# Altium project iMX6 Rex Development Baseboard V1I1.PrjPcb (part 2 of 2)
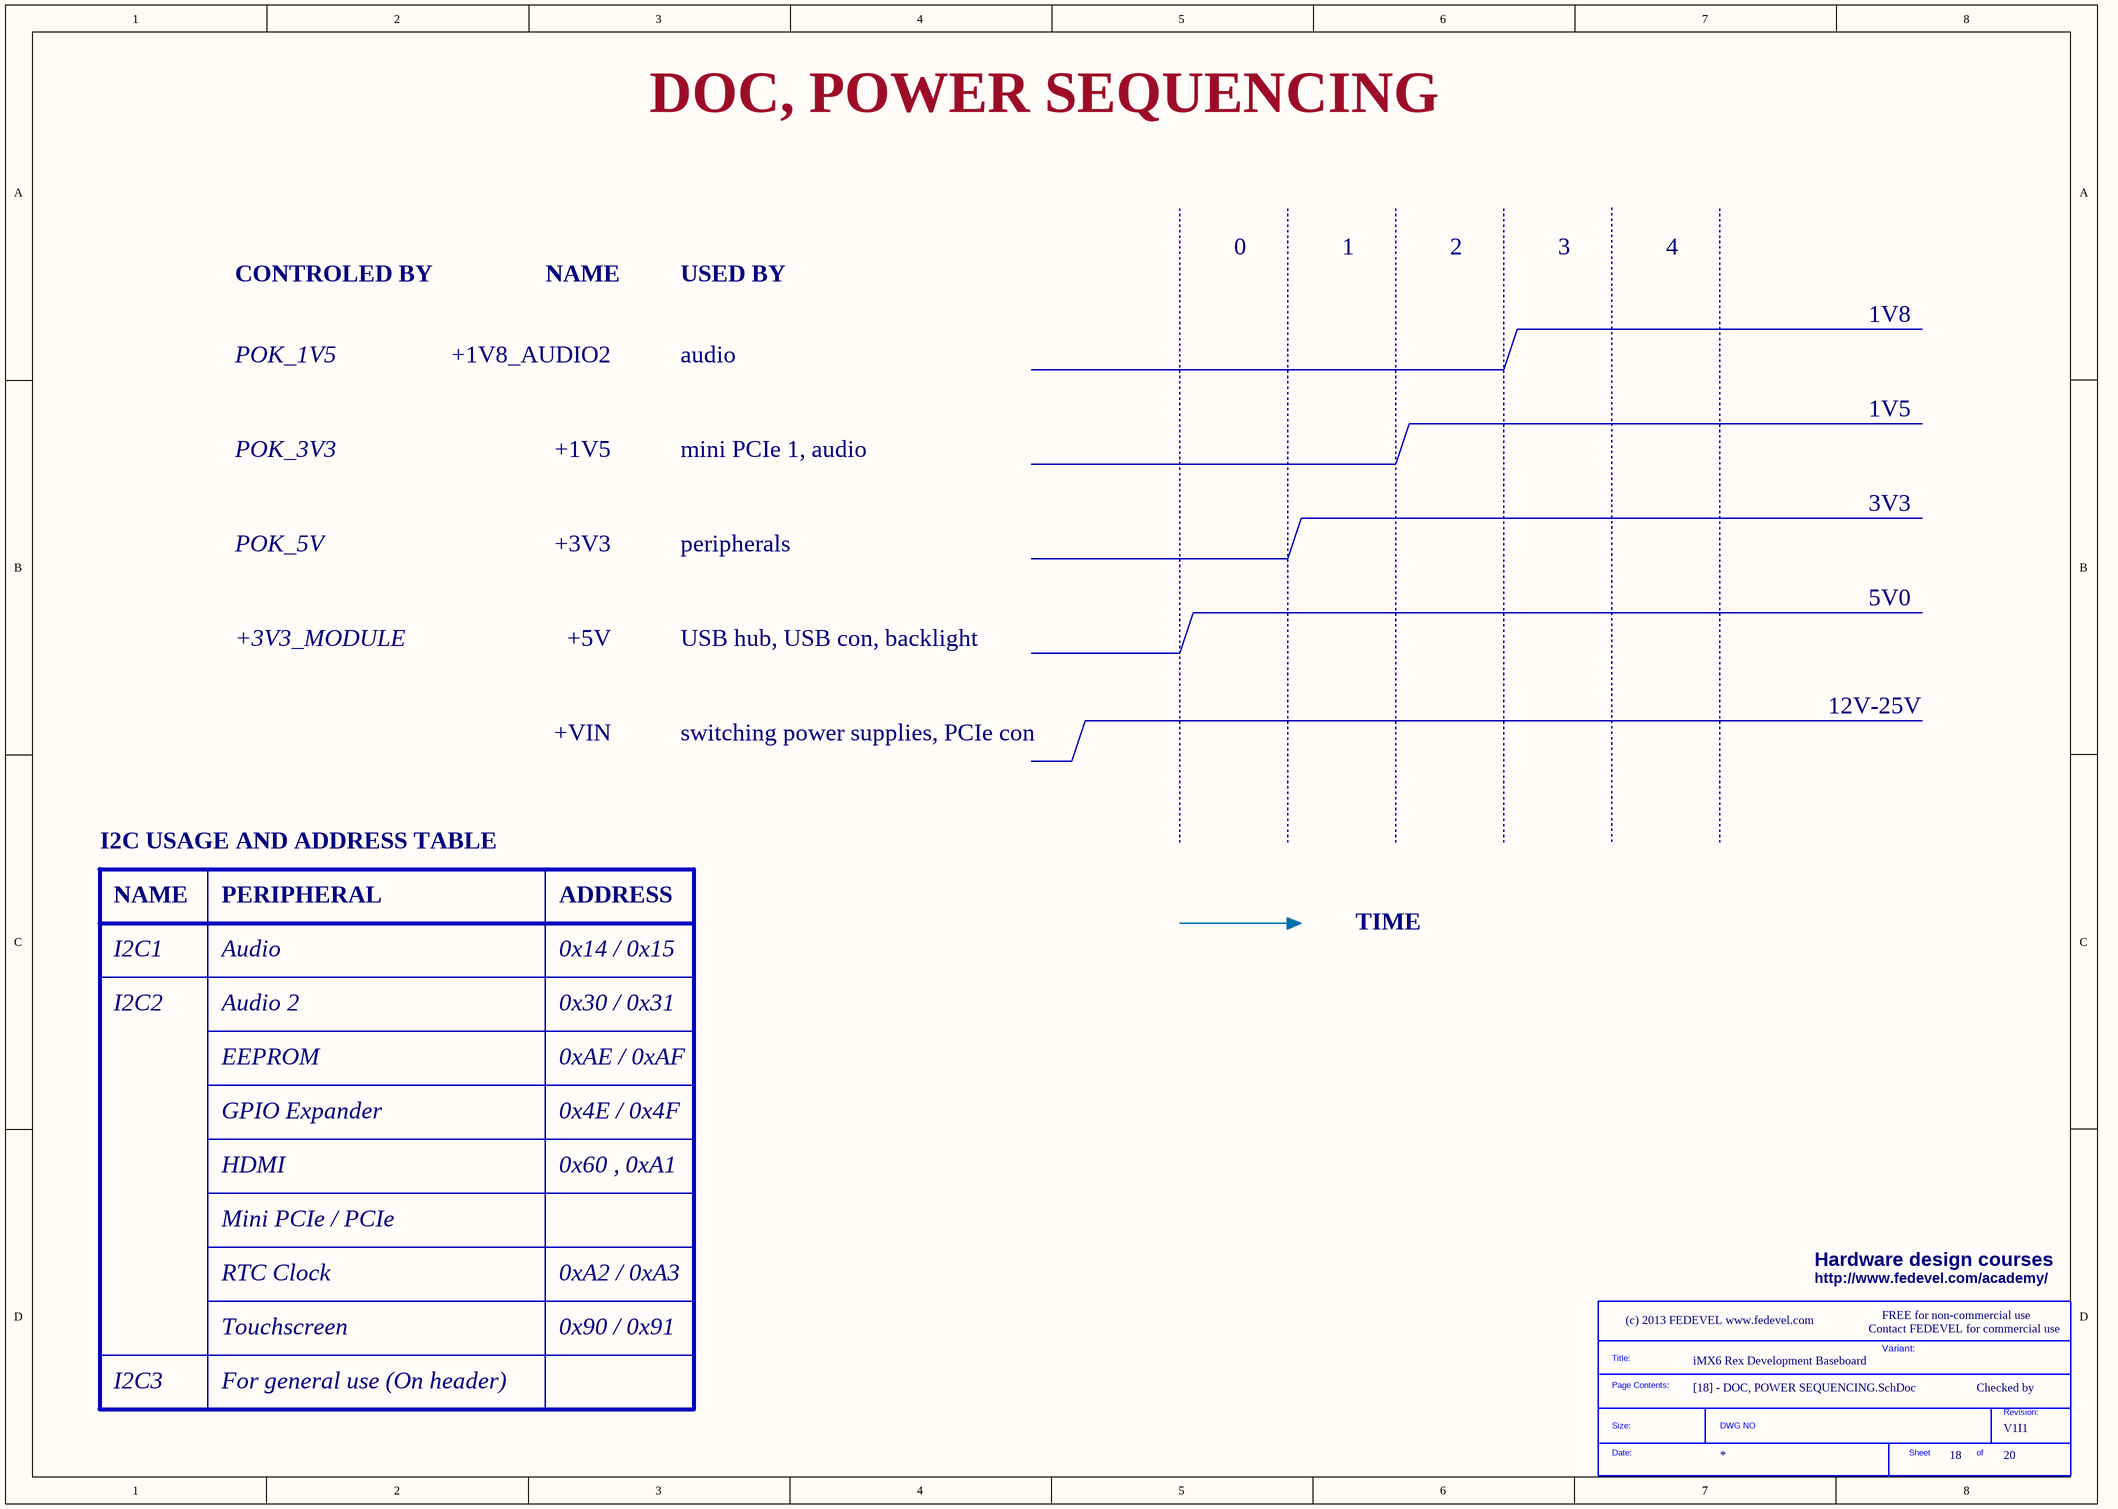
[diagram p5: [18] - DOC, POWER SEQUENCING.SchDoc]

## Nets that join several sheets
+3V3: [07] - HDMI (D7.2 R46.2), [15] - MISC, JTAG, HEADERS (22 pins)
+5V: [03] - CONNECTORS (R159.2), [07] - HDMI (C71.1 U7.1), [15] - MISC, JTAG, HEADERS (C177.1 C178.1 J35.1 J35.4)
GND: [03] - CONNECTORS (18 pins), [07] - HDMI (26 pins), [15] - MISC, JTAG, HEADERS (33 pins)
BOOT_MODE: [03] - CONNECTORS (J1.50), [15] - MISC, JTAG, HEADERS (JP2.1)
CPU_INT: [03] - CONNECTORS (J1.37), [15] - MISC, JTAG, HEADERS (J33.8)
CSPI2_CLK: [03] - CONNECTORS (J1.17), [15] - MISC, JTAG, HEADERS (J33.14)
CSPI2_CS0: [03] - CONNECTORS (J1.19), [15] - MISC, JTAG, HEADERS (J33.10)
CSPI2_MISO: [03] - CONNECTORS (J1.21), [15] - MISC, JTAG, HEADERS (J33.11)
CSPI2_MOSI: [03] - CONNECTORS (J1.23), [15] - MISC, JTAG, HEADERS (J33.12)
HDMI_CEC_IN: [03] - CONNECTORS (J1.44), [07] - HDMI (U7.16)
HDMI_CLK_N: [03] - CONNECTORS (J1.45), [07] - HDMI (J16.12 U7.15 U7.24)
HDMI_CLK_P: [03] - CONNECTORS (J1.47), [07] - HDMI (J16.10 U7.13 U7.26)
HDMI_D0_N: [03] - CONNECTORS (J1.39), [07] - HDMI (J16.9 U7.12 U7.27)
HDMI_D0_P: [03] - CONNECTORS (J1.41), [07] - HDMI (J16.7 U7.10 U7.29)
HDMI_D1_N: [03] - CONNECTORS (J1.46), [07] - HDMI (J16.6 U7.9 U7.30)
HDMI_D1_P: [03] - CONNECTORS (J1.48), [07] - HDMI (J16.4 U7.7 U7.32)
HDMI_D2_N: [03] - CONNECTORS (J1.40), [07] - HDMI (J16.3 U7.6 U7.33)
HDMI_D2_P: [03] - CONNECTORS (J1.42), [07] - HDMI (J16.1 U7.4 U7.35)
HDMI_HPD: [03] - CONNECTORS (J1.43), [07] - HDMI (U7.19)
I2C2_SCL: [03] - CONNECTORS (J1.36), [07] - HDMI (U7.17)
I2C2_SDA: [03] - CONNECTORS (J1.38), [07] - HDMI (U7.18)
I2C3_SCL: [03] - CONNECTORS (J2.19), [15] - MISC, JTAG, HEADERS (J34.10)
I2C3_SDA: [03] - CONNECTORS (J2.17), [15] - MISC, JTAG, HEADERS (J34.8)
JTAG_nTRST: [03] - CONNECTORS (J2.41), [15] - MISC, JTAG, HEADERS (J36.3)
JTAG_TCK: [03] - CONNECTORS (J2.43), [15] - MISC, JTAG, HEADERS (J36.9)
JTAG_TDI: [03] - CONNECTORS (J2.47), [15] - MISC, JTAG, HEADERS (J36.5)
JTAG_TDO: [03] - CONNECTORS (J2.45), [15] - MISC, JTAG, HEADERS (J36.13)
JTAG_TMS: [03] - CONNECTORS (J2.49), [15] - MISC, JTAG, HEADERS (J36.7)
SYS_POKn: [03] - CONNECTORS (J1.8), [15] - MISC, JTAG, HEADERS (U21.4)
SYS_RSTn: [03] - CONNECTORS (J1.7), [15] - MISC, JTAG, HEADERS (U20.1 U20.2)

## Assembly variants
Prototype: not fitted C16 C21 C26 C36 C95 C136 C138 C152 C153 C154 C155 C207 C208 C209 C210 C211 C212 C215 C217 D20 FB10 FB26 Q6 Q7 R1 R3 R5 R8 R10 R14 R24 R33 R36 R38 R40 R42 R52 R55 R59 R62 R64 R65 R68 R74 R75 R76 R88 R89 R104 R106 R111 R112 R113 R114 R116 R124 R125 R133 R151 R153 R154 R155 R156 R158 R160 R161 R162 R166 R168 R170 R171 R173 R174 R184 R185 U15